# EasyEDA schematic RobotSchematic.json
TITLE: Sheet_1; REV: 1.0; Date: 2021-04-15; Sheet: 1/1; Company: Your Company
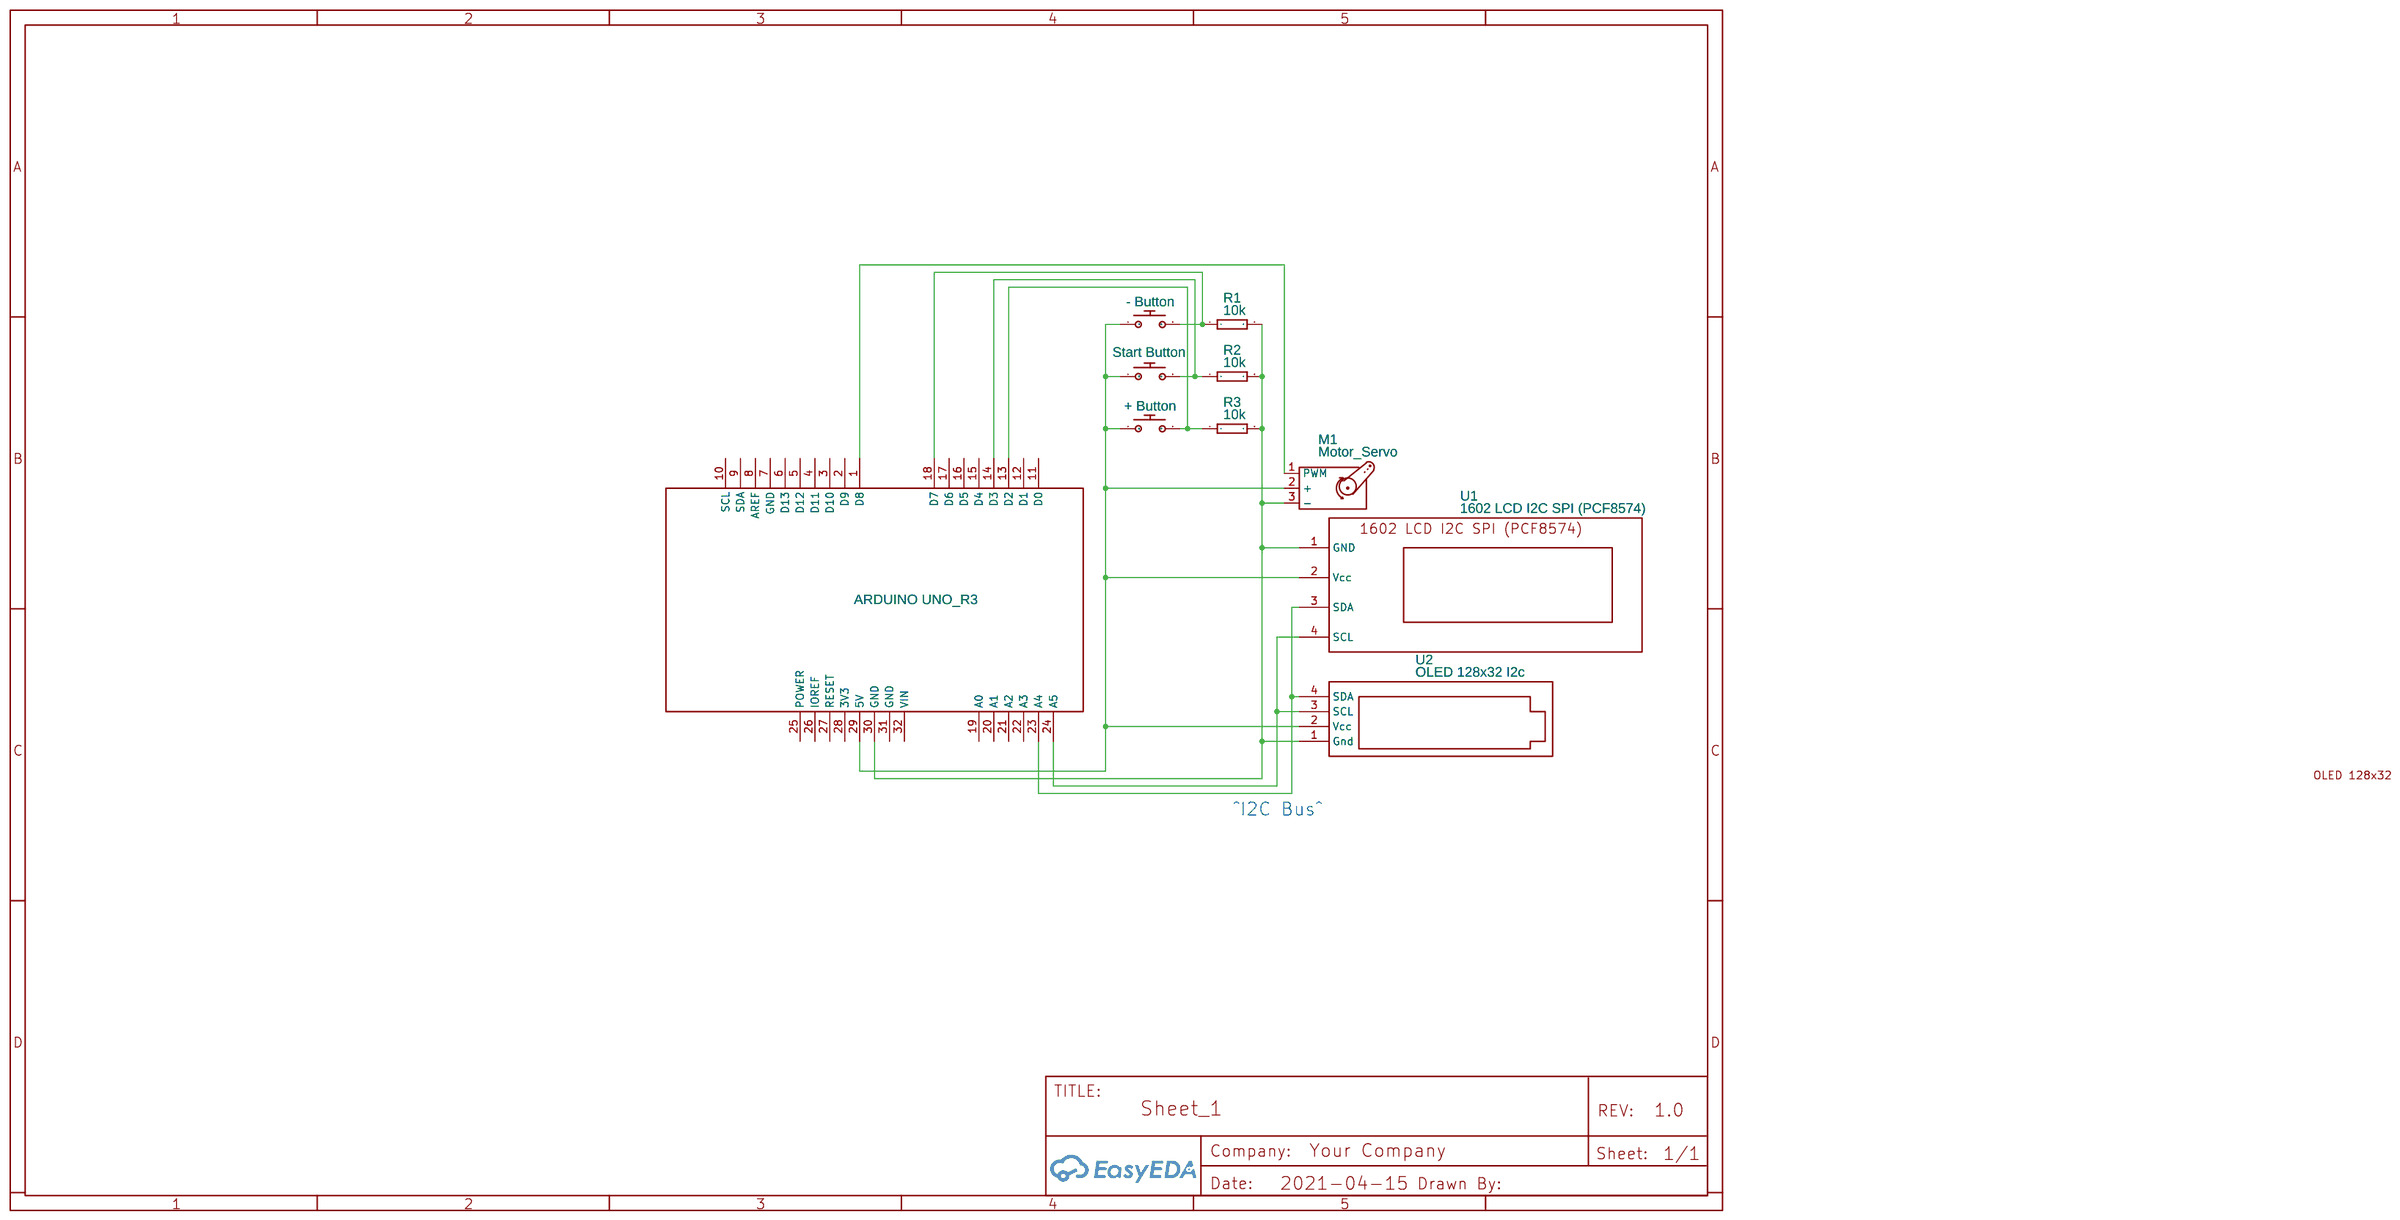
[diagram p0: schematic sheet]

## Parts
M1  Motor_Servo
P1  ARDUINO UNO_R3  [UNO_R3]
R1  10k  [R603]
R2  10k  [R603]
R3  10k  [R603]
SW-1SWITCH  - Button  [SMD-BUTTON]
SW-2SWITCH  Start Button  [SMD-BUTTON]
SW-3SWITCH  + Button  [SMD-BUTTON]
U1  1602 LCD I2C SPI (PCF8574)  [1602 LCD I2C SPI]
U2  OLED 128x32 I2c  [OLED 128X32]

## Library data of the parts
M1 = Motor_Servo: Contributor: KiCAD; license: https://www.gnu.org/licenses/lgpl-2.1.html
P1 = UNO_R3: sourceId: 1T5FDZYC8
R1-R3 = RESISTOR: Contributor: DangerousPrototype
SW-1SWITCH SW-2SWITCH SW-3SWITCH = Push Button: sourceId: M82WewO60; Supplier Part: COM-08720; Supplier: SparkFun
U1 = 1602 LCD I2C SPI (PCF8574): Contributor: Юрий Владимирович (Duck Duck)
U2 = OLED 128x32 I2c: Contributor: Robbejan

## Nets
Net-(M1-1): M1.1(PWM) P1.1(D8)
Net-(M1-2): M1.2(+) P1.29(5V) SW-1SWITCH.1(P$1) SW-2SWITCH.1(P$1) SW-3SWITCH.1(P$1) U1.2(Vcc) U2.2(Vcc)
Net-(M1-3): M1.3(-) P1.30(GND) R1.2 R2.2 R3.2 U1.1(GND) U2.1(Gnd)
Net-(P1-13): P1.13(D2) R3.1 SW-3SWITCH.2(P$2)
Net-(P1-14): P1.14(D3) R2.1 SW-2SWITCH.2(P$2)
Net-(P1-18): P1.18(D7) R1.1 SW-1SWITCH.2(P$2)
Net-(P1-23): P1.23(A4) U1.3(SDA) U2.4(SDA)
Net-(P1-24): P1.24(A5) U1.4(SCL) U2.3(SCL)

Not connected (* = marked no-connect by the designer): P1 2(D9) 3(D10) 4(D11) 5(D12) 6(D13) 7(GND) 8(AREF) 9(SDA) 10(SCL) 11(D0) 12(D1) 15(D4) 16(D5) 17(D6) 19(A0) 20(A1) 21(A2) 22(A3) 25(POWER) 26(IOREF) 27(RESET) 28(3V3) 31(GND) 32(VIN)

## Notes on the sheet
- ^I2C Bus^
